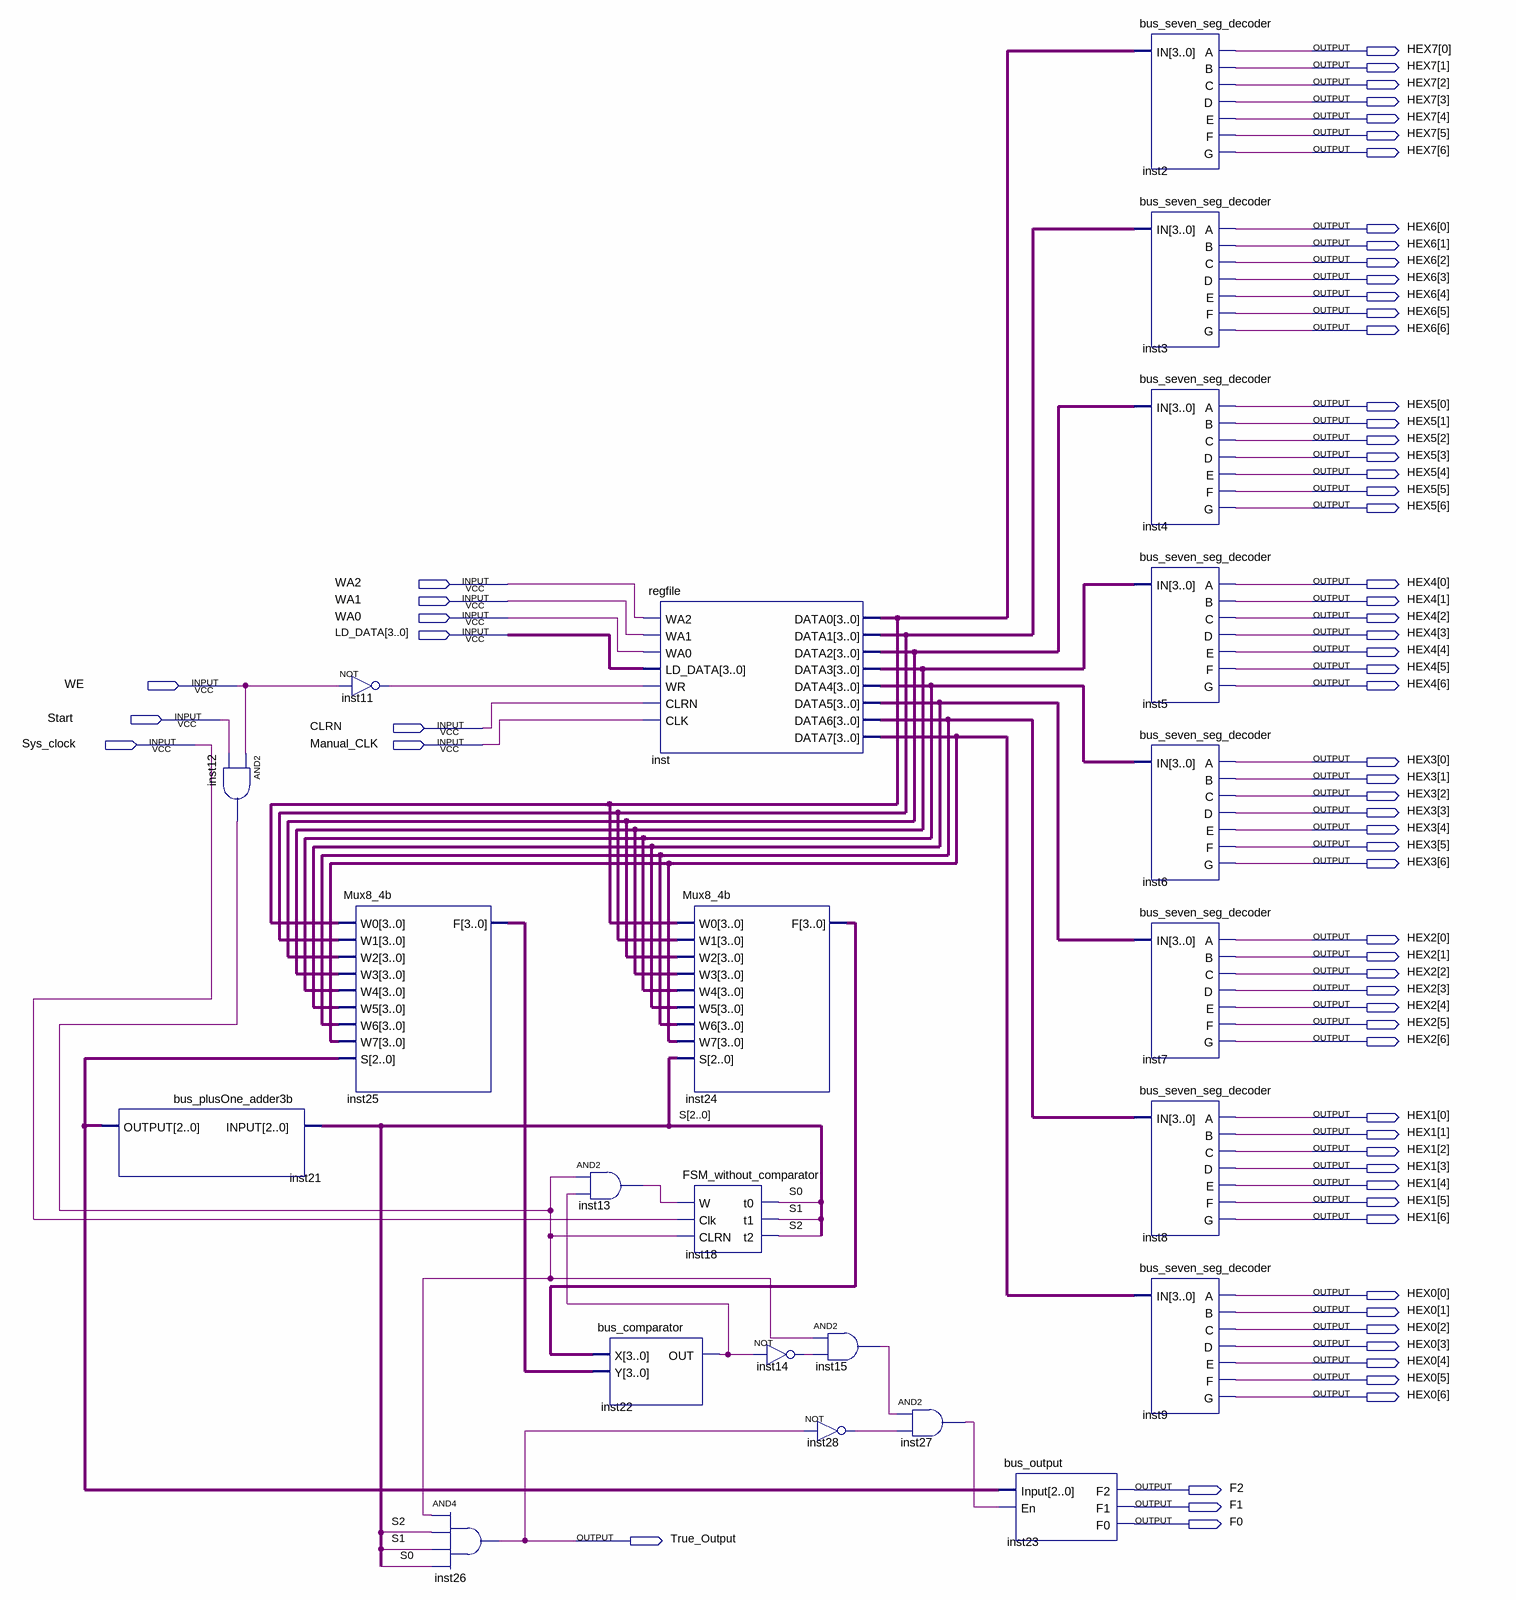
[diagram p0: schematic sheet]
// Quartus schematic 8dislplay.bdf as structural Verilog: 23 symbols, 69 pins
module \8dislplay  (
  input  WA2,
  input  WA1,
  input  WA0,
  input  [3:0] LD_DATA,
  input  WE,
  input  Start,
  input  CLRN,
  input  Sys_clock,
  input  Manual_CLK,
  output [6:0] HEX7,
  output [6:0] HEX6,
  output [6:0] HEX5,
  output [6:0] HEX4,
  output [6:0] HEX3,
  output [6:0] HEX2,
  output [6:0] HEX1,
  output [6:0] HEX0,
  output F2,
  output F1,
  output F0,
  output True_Output
);

  wire inst11_out, inst12_out, inst13_out, inst14_out, inst15_out, inst22_out, inst27_out, inst28_out;
  wire [2:0] inst21_output, S;
  wire [3:0] inst24_f, inst25_f, inst_data0, inst_data1, inst_data2, inst_data3, inst_data4, inst_data5,
       inst_data6, inst_data7;

  bus_plusOne_adder3b inst21 (.INPUT(S), .OUTPUT(inst21_output));
  and inst12 (inst12_out, WE, Start);
  not inst11 (inst11_out, WE);
  Mux8_4b inst25 (
    .W0(inst_data0), .W1(inst_data1), .W2(inst_data2), .W3(inst_data3), .W4(inst_data4), .W5(inst_data5),
    .W6(inst_data6), .W7(inst_data7), .S(inst21_output), .F(inst25_f));
  and inst26 (True_Output, inst12_out, S[2], S[1], S[0]);
  and inst13 (inst13_out, inst12_out, inst22_out);
  bus_comparator inst22 (.X(inst24_f), .Y(inst25_f), .OUT(inst22_out));
  regfile inst (
    .WA2(WA2), .WA1(WA1), .WA0(WA0), .LD_DATA(LD_DATA), .WR(inst11_out), .CLRN(CLRN), .CLK(Manual_CLK),
    .DATA0(inst_data0), .DATA1(inst_data1), .DATA2(inst_data2), .DATA3(inst_data3), .DATA4(inst_data4),
    .DATA5(inst_data5), .DATA6(inst_data6), .DATA7(inst_data7));
  Mux8_4b inst24 (
    .W0(inst_data0), .W1(inst_data1), .W2(inst_data2), .W3(inst_data3), .W4(inst_data4), .W5(inst_data5),
    .W6(inst_data6), .W7(inst_data7), .S(S), .F(inst24_f));
  FSM_without_comparator inst18 (.W(inst13_out), .Clk(Sys_clock), .CLRN(inst12_out), .t0(S[0]), .t1(S[1]), .t2(S[2]));
  and inst15 (inst15_out, inst12_out, inst14_out);
  not inst14 (inst14_out, inst22_out);
  not inst28 (inst28_out, True_Output);
  and inst27 (inst27_out, inst15_out, inst28_out);
  bus_output inst23 (.Input(inst21_output), .En(inst27_out), .F2(F2), .F1(F1), .F0(F0));
  bus_seven_seg_decoder inst2 (
    .IN(inst_data0), .A(HEX7[0]), .B(HEX7[1]), .C(HEX7[2]), .D(HEX7[3]), .E(HEX7[4]), .F(HEX7[5]), .G(HEX7[6]));
  bus_seven_seg_decoder inst3 (
    .IN(inst_data1), .A(HEX6[0]), .B(HEX6[1]), .C(HEX6[2]), .D(HEX6[3]), .E(HEX6[4]), .F(HEX6[5]), .G(HEX6[6]));
  bus_seven_seg_decoder inst4 (
    .IN(inst_data2), .A(HEX5[0]), .B(HEX5[1]), .C(HEX5[2]), .D(HEX5[3]), .E(HEX5[4]), .F(HEX5[5]), .G(HEX5[6]));
  bus_seven_seg_decoder inst5 (
    .IN(inst_data3), .A(HEX4[0]), .B(HEX4[1]), .C(HEX4[2]), .D(HEX4[3]), .E(HEX4[4]), .F(HEX4[5]), .G(HEX4[6]));
  bus_seven_seg_decoder inst6 (
    .IN(inst_data4), .A(HEX3[0]), .B(HEX3[1]), .C(HEX3[2]), .D(HEX3[3]), .E(HEX3[4]), .F(HEX3[5]), .G(HEX3[6]));
  bus_seven_seg_decoder inst7 (
    .IN(inst_data5), .A(HEX2[0]), .B(HEX2[1]), .C(HEX2[2]), .D(HEX2[3]), .E(HEX2[4]), .F(HEX2[5]), .G(HEX2[6]));
  bus_seven_seg_decoder inst8 (
    .IN(inst_data6), .A(HEX1[0]), .B(HEX1[1]), .C(HEX1[2]), .D(HEX1[3]), .E(HEX1[4]), .F(HEX1[5]), .G(HEX1[6]));
  bus_seven_seg_decoder inst9 (
    .IN(inst_data7), .A(HEX0[0]), .B(HEX0[1]), .C(HEX0[2]), .D(HEX0[3]), .E(HEX0[4]), .F(HEX0[5]), .G(HEX0[6]));
endmodule
